# EAGLE design power_v3 (EAGLE 9.6.2)
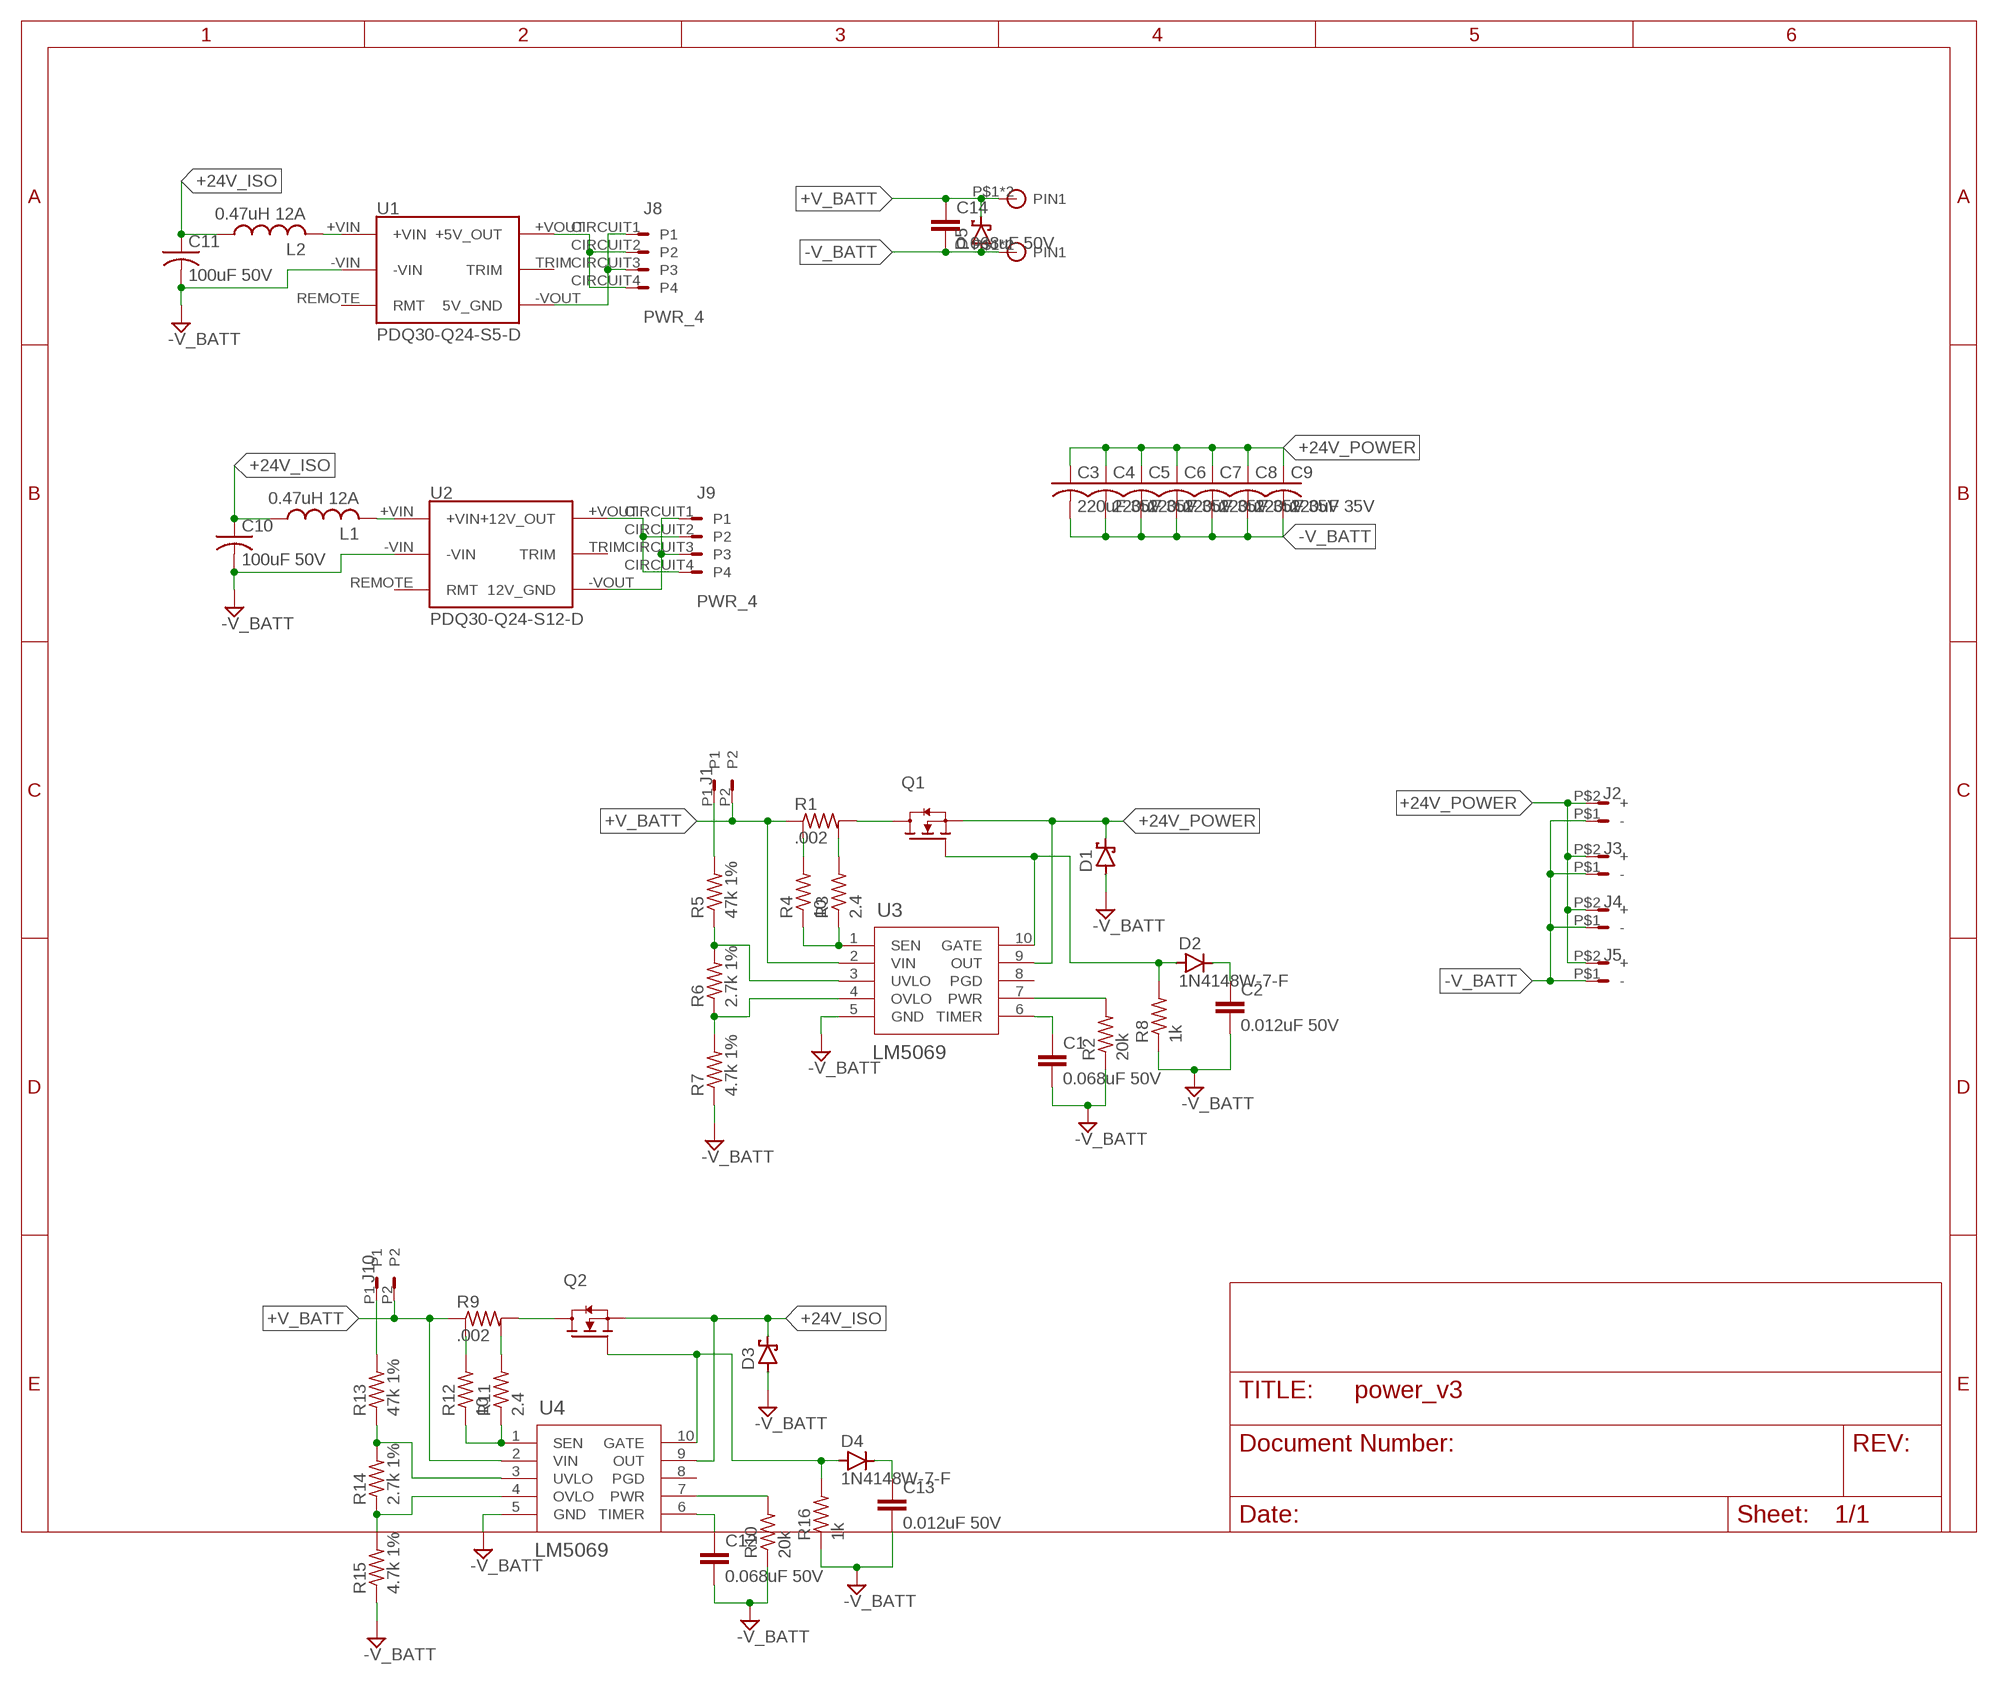
[diagram p0: schematic, sheet 1]

## Parts
C1  0.068uF 50V  C0603  [C0603]
C2  0.012uF 50V  C0603  [C0603]
C3  220uF 35V  C_POL  [C_POL_PANASONIC_F]
C4  220uF 35V  C_POL  [C_POL_PANASONIC_F]
C5  220uF 35V  C_POL  [C_POL_PANASONIC_F]
C6  220uF 35V  C_POL  [C_POL_PANASONIC_F]
C7  220uF 35V  C_POL  [C_POL_PANASONIC_F]
C8  220uF 35V  C_POL  [C_POL_PANASONIC_F]
C9  220uF 35V  C_POL  [C_POL_PANASONIC_F]
C10  100uF 50V  C_POL  [C_POL_PANASONIC_F]
C11  100uF 50V  C_POL  [C_POL_PANASONIC_F]
C12  0.068uF 50V  C0603  [C0603]
C13  0.012uF 50V  C0603  [C0603]
C14  0.068uF 50V  C0603  [C0603]
D1  5_0SMDJ24A  SCHOTTKY_SOD123  [SOD123]
D2  1N4148W-7-F  D  [SOD123]
D3  5_0SMDJ24A  SCHOTTKY_SOD123  [SOD123]
D4  1N4148W-7-F  D  [SOD123]
D5  5_0SMDJ24A  SCHOTTKY_SOD123  [SOD123]
J1  LINEAR_2_5040500291  [MOLEX_5040500291]
J2  PWR_2_XT30PW-F  [XT30PW-F]
J3  PWR_2_XT30PW-F  [XT30PW-F]
J4  PWR_2_XT30PW-F  [XT30PW-F]
J5  PWR_2_XT30PW-F  [XT30PW-F]
J6  FASTON  [FASTON_1289-ST]
J7  FASTON  [FASTON_1289-ST]
J8  PWR_4  [MOLEX_4_RA]
J9  PWR_4  [MOLEX_4_RA]
J10  LINEAR_2_5040500291  [MOLEX_5040500291]
L1  0.47uH 12A  L_SRP5030TA  [SRP5030TA]
L2  0.47uH 12A  L_SRP5030TA  [SRP5030TA]
Q1  CSD19536KTT  [TO-263]
Q2  CSD19536KTT  [TO-263]
R1  .002  R_SENSE_2512  [R2512_KELVIN]
R2  20k  R0603  [R0603]
R3  2.4  R0603  [R0603]
R4  10  R0603  [R0603]
R5  47k 1%  R0603  [R0603]
R6  2.7k 1%  R0603  [R0603]
R7  4.7k 1%  R0603  [R0603]
R8  1k  R0603  [R0603]
R9  .002  R_SENSE_2512  [R2512_KELVIN]
R10  20k  R0603  [R0603]
R11  2.4  R0603  [R0603]
R12  10  R0603  [R0603]
R13  47k 1%  R0603  [R0603]
R14  2.7k 1%  R0603  [R0603]
R15  4.7k 1%  R0603  [R0603]
R16  1k  R0603  [R0603]
U1  PDQ30-Q24-S5-D  [PDQ30-D]
U2  PDQ30-Q24-S12-D  [PDQ30-D]
U3  LM5069  [VSSOP_10]
U4  LM5069  [VSSOP_10]

## Nets
5V_GND [ISO]: J8.CIRCUIT1(P1) J8.CIRCUIT3(P3) U1.-VOUT(5V_GND)
12V_GND [ISO]: J9.CIRCUIT1(P1) J9.CIRCUIT3(P3) U2.-VOUT(12V_GND)
+5V [ISO]: J8.CIRCUIT2(P2) J8.CIRCUIT4(P4) U1.+VOUT(+5V_OUT)
+12V [ISO]: J9.CIRCUIT2(P2) J9.CIRCUIT4(P4) U2.+VOUT(+12V_OUT)
+24V_ISO: C10.POS C11.POS D3.C L1.P$1 L2.P$1 Q2.3(S) U4.9(OUT)
+24V_POWER: C3.POS C4.POS C5.POS C6.POS C7.POS C8.POS C9.POS D1.C J2.P$2(+) J3.P$2(+) J4.P$2(+) J5.P$2(+) Q1.3(S) U3.9(OUT)
+V_BATT: C14.1 D5.C J1.P2 J6.P$1(PIN1) J6.P$2(PIN1) J10.P2 R1.1A R1.1B R9.1A R9.1B U3.2(VIN) U4.2(VIN)
-V_BATT: C1.2 C2.2 C3.NEG C4.NEG C5.NEG C6.NEG C7.NEG C8.NEG C9.NEG C10.NEG C11.NEG C12.2 C13.2 C14.2 D1.A D3.A D5.A J2.P$1(-) J3.P$1(-) J4.P$1(-) J5.P$1(-) J7.P$1(PIN1) J7.P$2(PIN1) R2.1 R7.1 R8.1 R10.1 R15.1 R16.1 U1.-VIN U2.-VIN U3.5(GND) U4.5(GND)
N$1: Q1.2(D) R1.2A R1.2B
N$2: D2.A Q1.1(G) R8.2 U3.10(GATE)
N$3: C1.1 U3.6(TIMER)
N$4: R2.2 U3.7(PWR)
N$5: R3.1 R4.1 U3.1(SEN)
N$6: R1.2_KELVIN(K2) R3.2
N$7: J1.P1 R5.2
N$8: R5.1 R6.2 U3.3(UVLO)
N$9: R6.1 R7.2 U3.4(OVLO)
N$10: R1.1_KELVIN(K1) R4.2
N$11: C2.1 D2.C
N$12: L1.P$2 U2.+VIN
N$13: L2.P$2 U1.+VIN
N$14: Q2.2(D) R9.2A R9.2B
N$15: C12.1 U4.6(TIMER)
N$16: R10.2 U4.7(PWR)
N$17: R11.1 R12.1 U4.1(SEN)
N$18: R9.2_KELVIN(K2) R11.2
N$19: R13.1 R14.2 U4.3(UVLO)
N$20: R14.1 R15.2 U4.4(OVLO)
N$21: J10.P1 R13.2
N$22: R9.1_KELVIN(K1) R12.2
N$23: C13.1 D4.C
N$24: D4.A Q2.1(G) R16.2 U4.10(GATE)
Unconnected: J1.MNT@1(GND) J1.MNT@2(GND) J2.P$3(GND) J2.P$4(GND) J3.P$3(GND) J3.P$4(GND) J4.P$3(GND) J4.P$4(GND) J5.P$3(GND) J5.P$4(GND) J10.MNT@1(GND) J10.MNT@2(GND) U1.REMOTE(RMT) U1.TRIM U2.REMOTE(RMT) U2.TRIM U3.8(PGD) U4.8(PGD)

## Library data of the parts
C1 C2 C12-C14 = _T_rcl:C
C3-C11 = _T_rcl:C_POL
D1 D3 D5 = _T_rcl:SCHOTTKY
D2 D4 = _T_rcl:D
J1 J10 = _T_conn:LINEAR_2
J2-J5 = _T_conn:PWR_2
J6 J7 = _T_power:FASTON
J8 J9 = _T_conn:PWR_4
L1 L2 = _T_rcl:L
Q1 Q2 = _T_transistors:CSD19536KTT
R1 R9 = _T_rcl:R_SENSE
R2-R8 R10-R16 = _T_rcl:R
U1 = _T_power:PDQ30-Q24-S5-D
U2 = _T_power:PDQ30-Q24-S12-D
U3 U4 = _T_ic:LM5069

## Net classes
0 default: width 0.2 mm
1 ISO: width 2 mm, clearance 0.5 mm

## Board
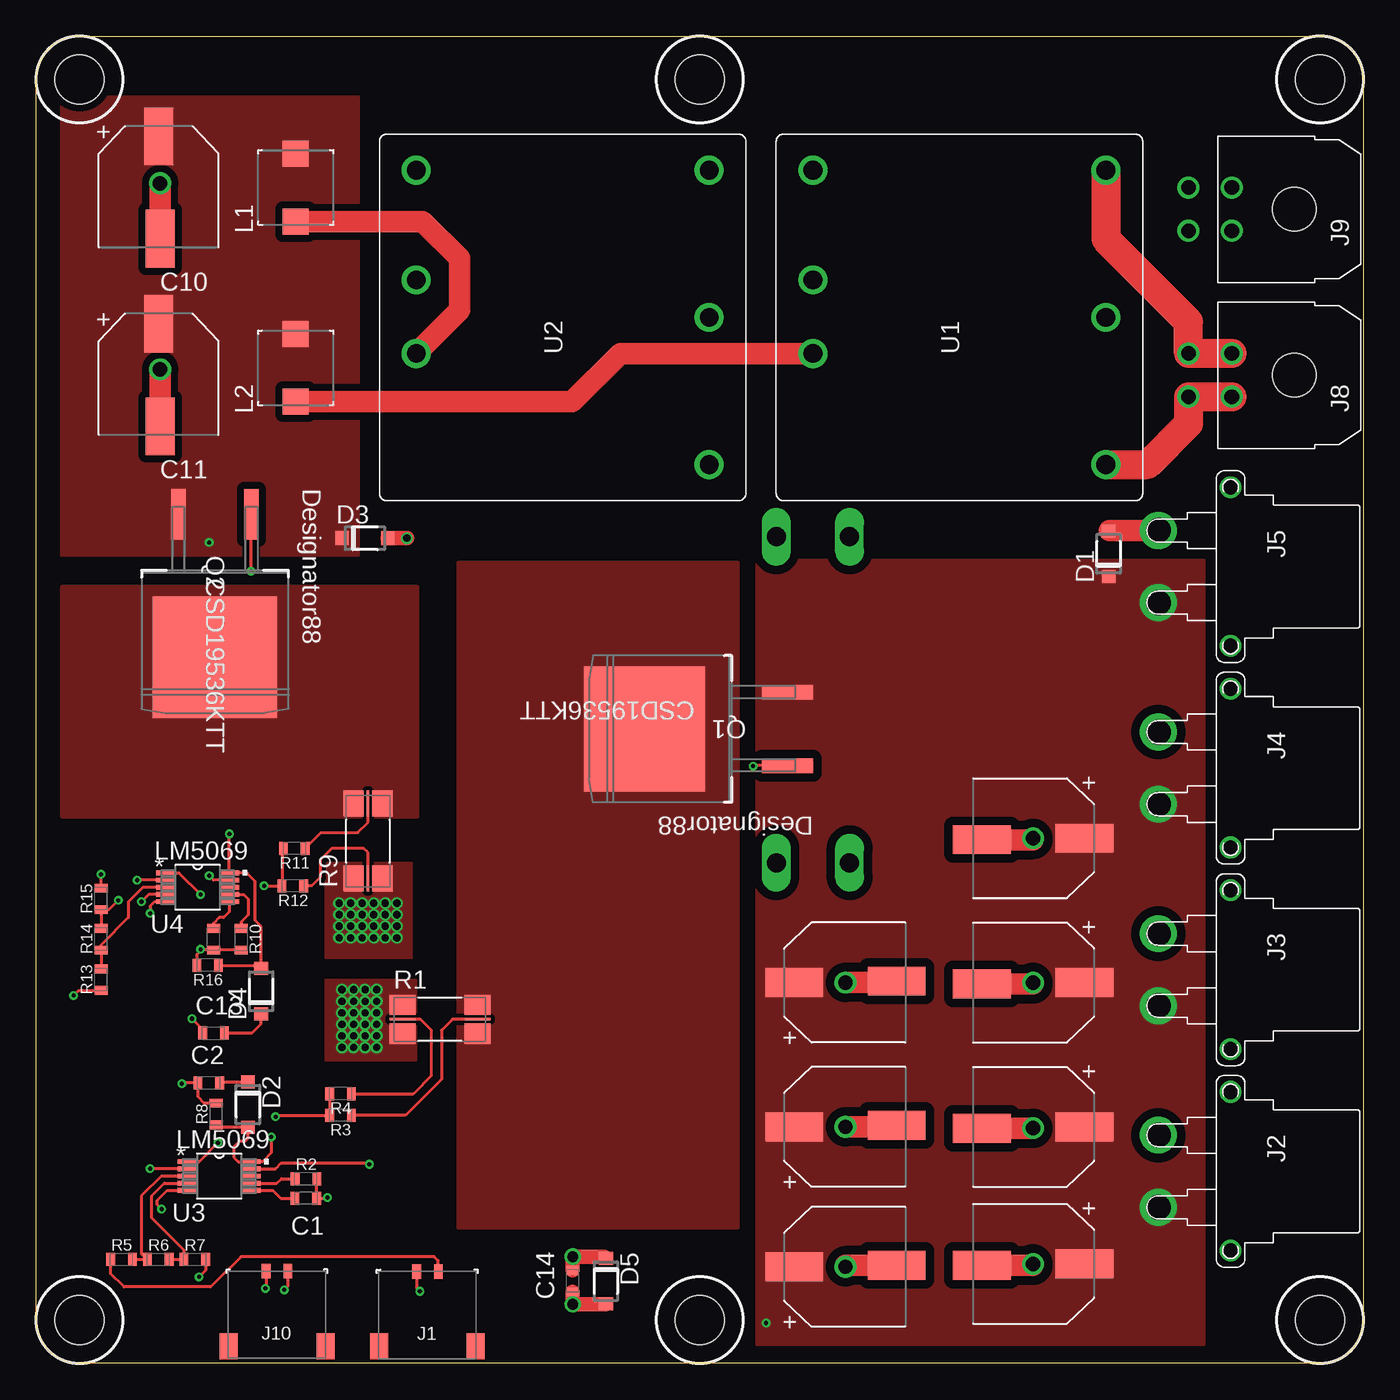
[diagram p1: board, top side]
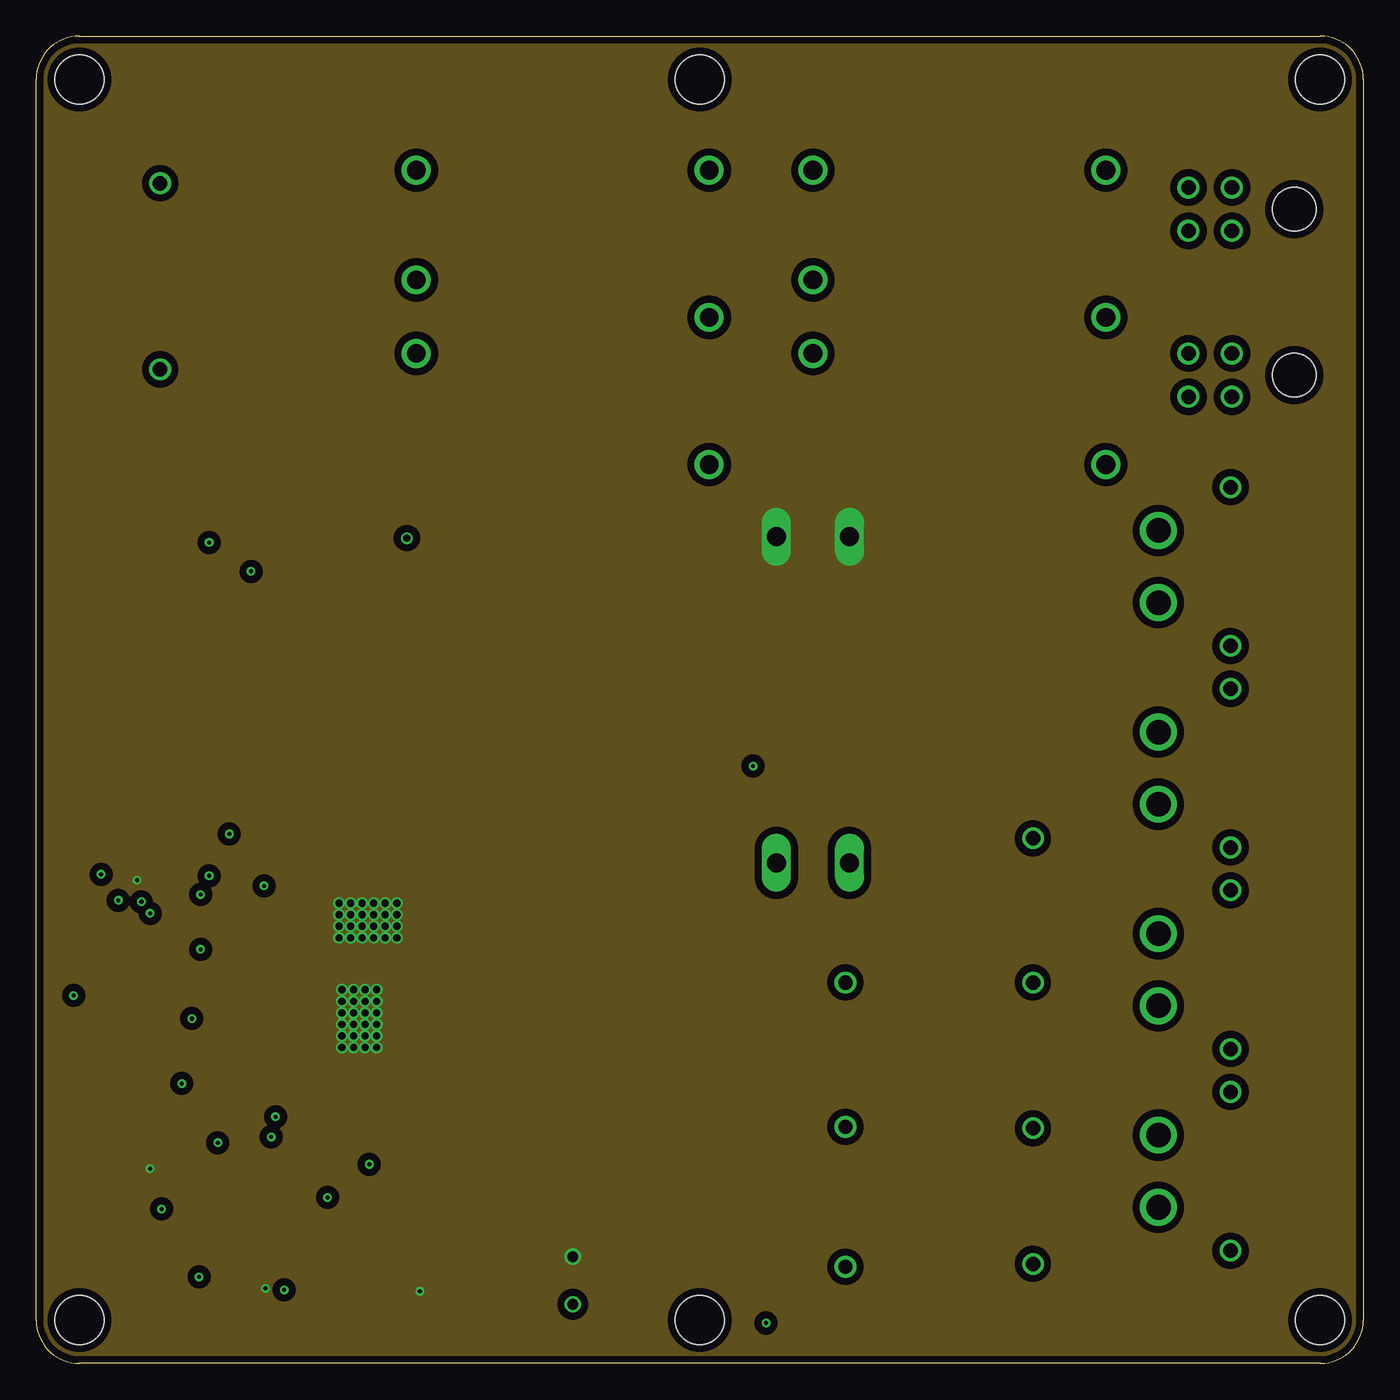
[diagram p2: board, inner layer Route2]
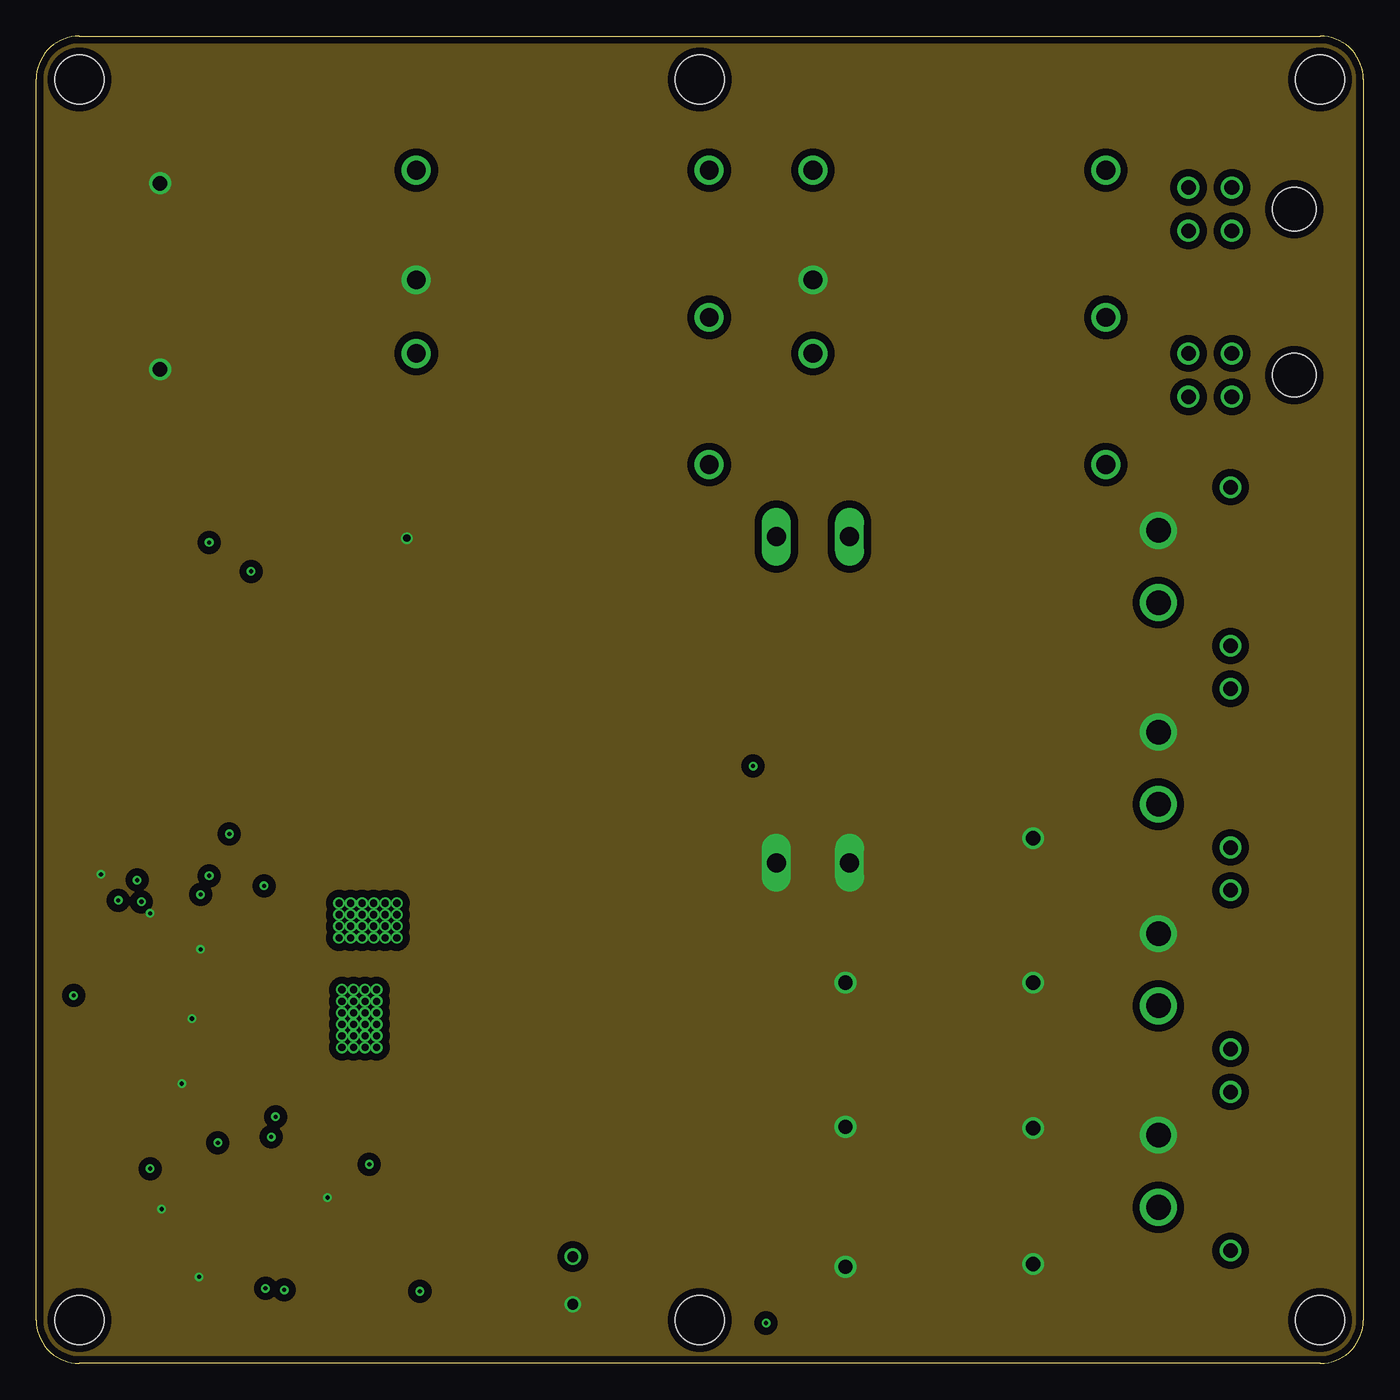
[diagram p3: board, inner layer Route15]
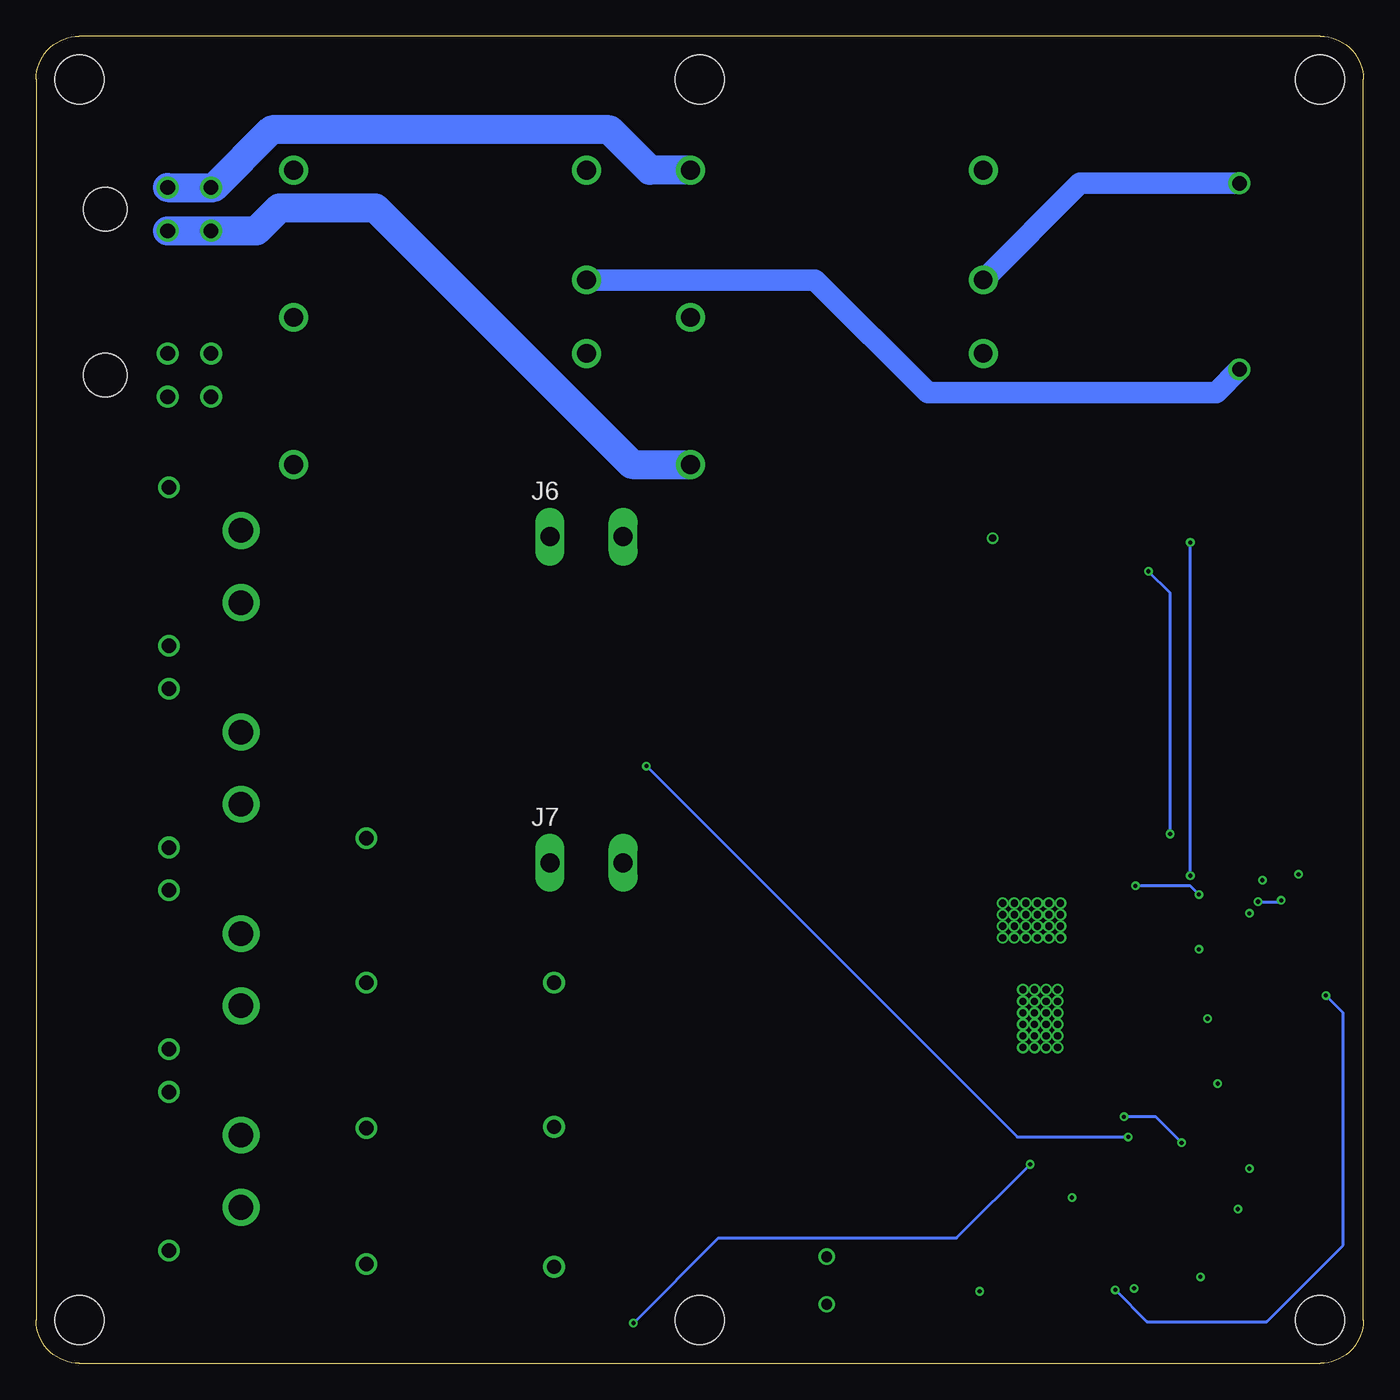
[diagram p4: board, bottom side, seen from below]

Size 92 x 92 mm. Coordinates in mm from the lower left corner, seen from the top.
Outline: 3,92 arc90 0,89 0,3 arc90 3,0 89,0 arc90 92,3 92,89 arc90 89,92 3,92
Copper layers (1*2*15*16): Top 0.035mm / dielectric 0.11mm / Route2 0.035mm / dielectric 1.31mm / Route15 0.035mm / dielectric 0.11mm / Bottom 0.035mm
Design rules "pcbway_4_layer_TIM": minimum track width 6mil, minimum drill 0.29mm, track to track 6mil, track to pad 6mil, pad to pad 6mil, via to via 6mil, smd to smd 0mil, copper to edge 0.25mm, drill to drill 10mil, minimum pad ring 6mil, minimum via ring 6mil, stop-mask expansion 2mil, vias tented up to drill 0mil, thermal gap 10mil
Holes 3.4 mm at 3,89 46,89 89,89 89,3 46,3 3,3

### Footprints (pad centres in the part's own frame; a part is rotated, then mirrored left to right if it is on the bottom)
C0603 = smd 0.6 x 0.9: 1 0.75,0; 2 -0.75,0
C_POL_PANASONIC_F = smd 2 x 4: NEG -0.1,3.55; POS 0,-3.55
SOD123 = smd 0.9 x 0.95: A 1.575,0; C -1.575,0
MOLEX_5040500291 = smd 1.25 x 1.8: MNT@1 3.355,5.2; MNT@2 -3.355,5.2 | smd 0.6 x 1: P1 -0.75,0.01; P2 0.75,0.01
XT30PW-F = drill 1.7: P$1 -2.5,-5; P$2 2.5,-5 | drill 1: P$3 5.5,0; P$4 -5.5,0
FASTON_1289-ST = drill 1.32 pad 2 long: P$1 -2.54,0; P$2 2.54,0
MOLEX_4_RA = drill 1.016: CIRCUIT1 1.5,4.32; CIRCUIT2 -1.5,4.318; CIRCUIT3 1.5,7.32; CIRCUIT4 -1.5,7.32 | hole 3: 0,0
SRP5030TA = smd 1.8 x 1.8: P$1 2.35,0; P$2 -2.35,0
TO-263 = smd 3.5 x 1: 1 -6.15,2.54; 3 -6.15,-2.54 | smd 8.4 x 8.65: 2 3.75,0
R2512_KELVIN = smd 1.8 x 0.2: 1_KELVIN -2.6,0; 2_KELVIN 2.6,0 | smd 1.8 x 1.4: 1A -2.6,1; 1B -2.6,-1; 2A 2.6,1; 2B 2.6,-1
R0603 = smd 0.6 x 0.9: 1 0.75,0; 2 -0.75,0
PDQ30-D = drill 1.3 pad 2: +VIN -2.5,10.15; +VOUT -10.2,-10.15; -VIN 2.6,10.15; -VOUT 10.2,-10.15; REMOTE 10.2,10.15; TRIM 0,-10.15
VSSOP_10 = smd 1.372 x 0.33: 1 -2.197,1; 2 -2.197,0.5; 3 -2.197,0; 4 -2.197,-0.5; 5 -2.197,-1; 6 2.197,-1; 7 2.197,-0.5; 8 2.197,0; 9 2.197,0.5; 10 2.197,1

### Placement (x,y rotation side)
C1  18.7,11.44 180 top
C2  11.97,19.46 0 top
C3  69.1,16.4 90 top
C4  69.1,26.4 90 top
C5  69.1,36.4 90 top
C6  56.1,6.7 270 top
C7  56.1,16.4 270 top
C8  56.1,26.4 270 top
C9  69.1,6.9 90 top
C10  8.5,81.5 180 top
C11  8.5,68.5 180 top
C12  12.3,29.4 90 top
C13  12.3,22.9 0 top
C14  37.2,5.7 90 top
D1  74.34,56.12 90 top
D2  14.68,17.94 270 top
D3  22.8,57.2 0 top
D4  15.6,25.8 90 top
D5  39.5,5.7 270 top
J1  27.12,6.38 180 top
J2  82.79,13.32 270 top
J3  82.79,27.29 270 top
J4  82.79,41.26 270 top
J5  82.79,55.23 270 top
J6  53.85,57.3 0 bottom
J7  53.85,34.7 0 bottom
J8  87.2,68.5 90 top
J9  87.2,80 90 top
J10  16.7,6.4 180 top
L1  18,81.5 90 top
L2  18,69 90 top
Q1  45.93,43.97 180 top
Q2  12.4,52.7 270 top
R1  27.99,23.86 0 top
R2  18.71,12.81 0 top
R3  21.1,17.2 180 top
R4  21.1,18.7 180 top
R5  5.92,7.21 0 top
R6  8.48,7.21 0 top
R7  11,7.21 0 top
R8  12.49,17.29 90 top
R9  23,36.2 90 top
R10  14.2,29.4 270 top
R11  17.9,35.7 180 top
R12  17.8,33.1 180 top
R13  4.5,26.6 90 top
R14  4.5,29.4 90 top
R15  4.5,32.2 90 top
R16  11.9,27.6 180 top
U1  64,72.5 90 top
U2  36.5,72.5 90 top
U3  12.7,12.99 0 top
U4  11.2,33 0 top

### Tracks (layer width: path | path; a pad name or v marks a point on that pad's centre or on a via)
5V_GND
  Top 2: J8.CIRCUIT1 J8.CIRCUIT3 79.88,72.2 74.15,77.93 U1.-VOUT
12V_GND
  Bottom 2: U2.-VOUT 49.45,82.7 52.25,85.5 75.66,85.5 79.66,81.5 J9.CIRCUIT3 J9.CIRCUIT1
+5V
  Top 2: U1.+VOUT 77.05,62.3 79.88,65.13 J8.CIRCUIT4 J8.CIRCUIT2
+12V
  Bottom 2: J9.CIRCUIT2 J9.CIRCUIT4 76.72,78.5 75.12,80.1 68.5,80.1 50.7,62.3 U2.+VOUT
+24V_ISO  (via drill 0.29)
  Top 0.2: U4.9 12.3,33.5 v12,33.8
  Bottom 0.2: v12,33.8 v12,56.9
  pour Top (isolate 0.5, no thermals): 1.7,87.8 1.7,56 22.4,56 22.4,87.8
+24V_POWER  (via drill 0.29)
  Top 0.2: U3.9 16.59,13.49 17,13.9 23,13.9 v23.1,13.8
  Bottom 0.2: v23.1,13.8 28.2,8.7 44.7,8.7 v50.6,2.8
  pour Top (isolate 0.6, no thermals): 49.9,1.3 81,1.3 81,55.7 49.9,55.7
+V_BATT  (via drill 0.29, 0.5, 0.75)
  Top 0.2: J10.P2 15.95,5.25 v15.9,5.2 | U4.2 v7,33.5 | J1.P2 26.37,5.23 v26.6,5 | U3.2 v7.91,13.49 v7.9,13.5 | D5.C 39.38,7.4
  Top 1: C14.1 v37.2,7.4 39.38,7.4
  other vias: 21,31.9 21.8,31.9 22.6,31.9 23.4,31.9 24.2,31.9 25,31.9 21,31.1 21.8,31.1 22.6,31.1 23.4,31.1 24.2,31.1 25,31.1 21,30.3 21.8,30.3 22.6,30.3 23.4,30.3 24.2,30.3 25,30.3 21,29.5 21.8,29.5 22.6,29.5 23.4,29.5 24.2,29.5 25,29.5 23.6,25.9 23.6,25.1 23.6,24.3 23.6,23.5 23.6,22.7 23.6,21.9 22.8,25.9 22.8,25.1 22.8,24.3 22.8,23.5 22.8,22.7 22.8,21.9 22,25.9 22,25.1 22,24.3 22,23.5 22,22.7 22,21.9 21.2,25.9 21.2,25.1 21.2,24.3 21.2,23.5 21.2,22.7 21.2,21.9
  pour Route2 (isolate 0.5): -2.3,93.5 93.6,93.5 93.6,-0.9 -2.3,-0.9
  pour Top (isolate 0.3, no thermals): 20.1,34.7 26,34.7 26,28.1 20.1,28.1
  pour Top (isolate 0.3, no thermals): 20.1,26.6 26.3,26.6 26.3,21 20.1,21
-V_BATT  (via drill 0.29, 0.5, 0.75, 1)
  Top 0.2: R15.1 v4.5,33.9 | R10.1 C12.2 11.45,28.65 | C13.2 11.55,23.15 v10.8,23.9 | U4.5 8.2,32 7.9,31.7 v7.9,31.2 | 11.45,28.65 v11.4,28.7 | R16.1 11.15,28.35 11.45,28.65 | R7.1 11.75,6.45 v11.3,6 | v8.7,10.7 8.4,11 8.4,11.3 9.09,11.99 U3.5 | v10.1,19.4 10.16,19.46 C2.2 11.22,18.48 11.66,18.04 R8.1 | R2.1 C1.2 20.14,11.44 v20.2,11.5 | D1.A 74.38,57.73 | D5.A 39.48,4.1
  Top 1: D3.A v25.7,57.2 | C14.2 v37.2,4.1 39.48,4.1
  Top 1.5: C10.NEG v8.6,81.8 | C11.NEG v8.6,68.9 | C7.NEG 59.55,16.4 v56.1,16.4 | C6.NEG 56.1,6.8 v56.1,6.7 | C9.NEG 69.1,6.8 v69.1,6.9 | C3.NEG v69.1,16.3 | C4.NEG 69.1,26.3 v69.1,26.4 | C5.NEG 69.1,36.3 v69.1,36.4 | C8.NEG 59.65,26.4 v56.1,26.4 | 74.38,57.73 J5.P$1
  Bottom 1.5: v8.6,81.8 19.65,81.8 U2.-VIN | v8.6,68.9 10.2,67.3 30.2,67.3 38,75.1 U1.-VIN
  pour Route15 (isolate 0.5): -3,95.5 94,95.5 94,-4.5 -3,-4.5
N$1
  pour Top (isolate 0.3, no thermals): 48.7,55.5 29.2,55.5 29.2,9.4 48.7,9.4
N$2  (via drill 0.29)
  Top 0.2: R8.2 12.66,16.36 D2.A 14.68,15.58 14.5,15.4 14.1,15.4 13.7,15 13.7,14.3 14.01,13.99 U3.10 15.69,13.99 16.3,14.6 v16.3,15.7 | Q1.1 49.73,41.43 v49.7,41.4
  Bottom 0.2: v49.7,41.4 24,15.7 v16.3,15.7
N$3
  Top 0.2: U3.6 16.41,11.99 16.96,11.44 C1.1
N$4
  Top 0.2: U3.7 16.69,12.49 17.01,12.81 R2.2
N$5  (via drill 0.29)
  Top 0.2: R4.1 R3.1 16.7,17.2 v16.6,17.1 | U3.1 11.29,13.99 v12.6,15.3
  Bottom 0.2: v12.6,15.3 14.4,17.1 v16.6,17.1
N$6
  Top 0.2: R1.2_KELVIN 28.86,23.86 28.1,23.1 28.1,19.7 25.6,17.2 R3.2
N$7
  Top 0.2: J1.P1 27.87,7.13 27.6,7.4 14.2,7.4 12.1,5.3 6.1,5.3 5.17,6.23 R5.2
N$8
  Top 0.2: R5.1 7.7,7.21 | 7.7,7.21 R6.2 | 7.7,7.21 7.3,7.61 7.3,11.6 8.69,12.99 U3.3
N$9
  Top 0.2: R6.1 R7.2 10.25,7.85 8,10.1 8,11.6 8.89,12.49 U3.4
N$10
  Top 0.2: R4.2 26.15,18.7 27.4,19.95 27.4,23.1 26.64,23.86 R1.1_KELVIN
N$11
  Top 0.2: C2.1 12.78,19.52 D2.C
N$12
  Top 1.5: U2.+VIN 29.35,73 29.35,76.6 26.8,79.15 L1.P$2
N$13
  Top 1.5: L2.P$2 37.15,66.65 40.5,70 U1.+VIN
N$14
  pour Top (isolate 0.3, no thermals): 1.8,53.8 26.4,53.8 26.4,37.9 1.8,37.9
N$15
  Top 0.2: U4.6 13.4,31.3 13,30.9 12.7,30.9 12.3,30.5 C12.1
N$16
  Top 0.2: U4.7 14.4,32.5 14.7,32.2 14.7,31.1 14.2,30.6 R10.2
N$17  (via drill 0.29)
  Top 0.2: R11.1 17.05,35.6 R12.1 v15.8,33.1 | U4.1 9.9,34 v11.4,32.5
  Bottom 0.2: v11.4,32.5 12,33.1 v15.8,33.1
N$18
  Top 0.2: R11.2 19.75,36.8 22.3,36.8 23,37.5 R9.2_KELVIN
N$19
  Top 0.2: U4.3 7.4,33 6.4,32 6.4,30.9 4.5,29 R14.2 R13.1
N$20  (via drill 0.29)
  Top 0.2: R14.1 R15.2 5.05,31.45 v5.7,32.1 | U4.4 7.8,32.5 v7.3,32
  Bottom 0.2: v7.3,32 5.8,32 v5.7,32.1
N$21  (via drill 0.29)
  Top 0.2: J10.P1 17.45,5.35 v17.2,5.1 | v2.6,25.5 2.95,25.85 R13.2
  Bottom 0.2: v17.2,5.1 15,2.9 6.7,2.9 1.4,8.2 1.4,24.3 v2.6,25.5
N$22
  Top 0.2: R9.1_KELVIN 23,35.4 22.7,35.7 20.5,35.7 19.7,34.9 19.7,33.7 19.1,33.1 R12.2
N$23
  Top 0.2: C13.1 14.97,22.9 15.6,23.52 D4.C
N$24  (via drill 0.29)
  Top 0.2: R16.2 15.38,27.6 D4.A 15.6,30.3 15.2,30.7 15.2,33.4 14.6,34 U4.10 v13.4,36.7 | v14.9,54.9 14.9,58.81 Q2.1
  Bottom 0.2: v13.4,36.7 13.4,53.4 v14.9,54.9